# EAGLE design nedonand8 (EAGLE 5.12)
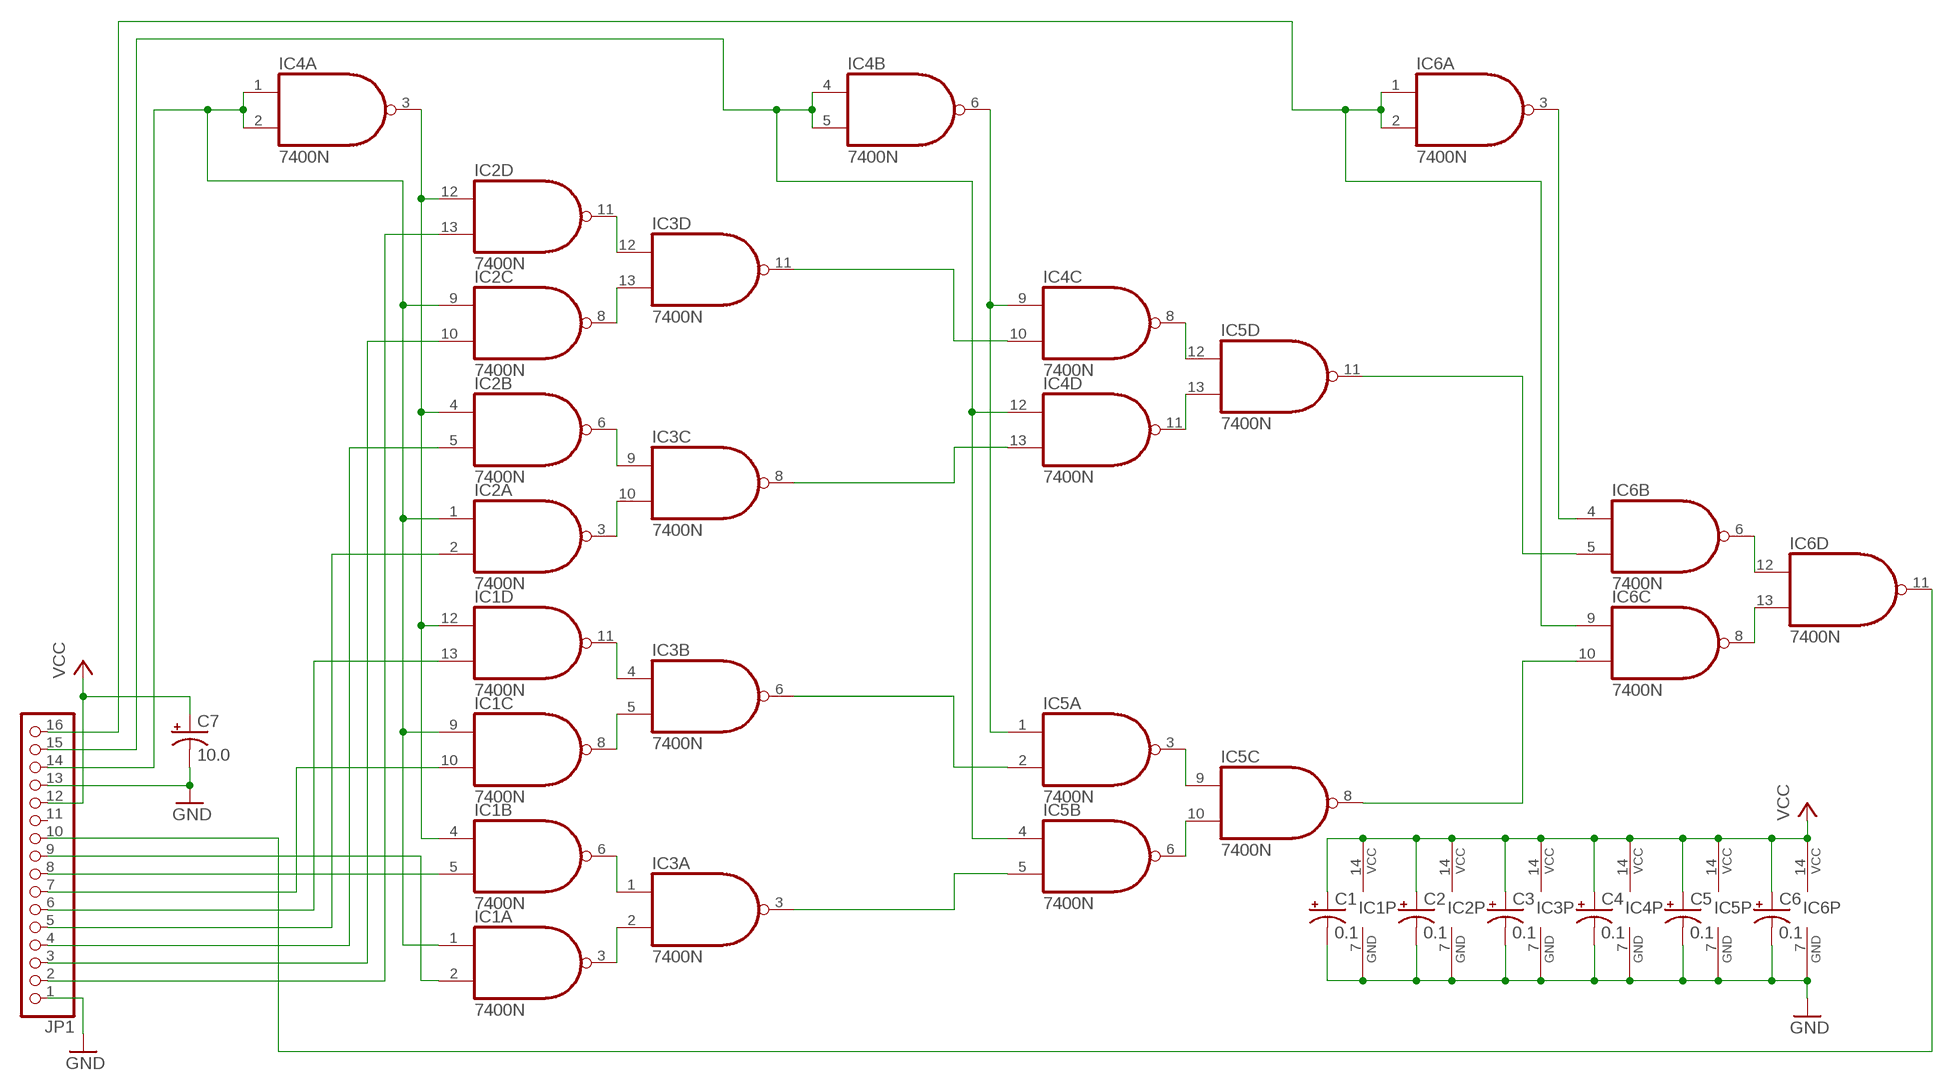
[diagram p0: schematic, sheet 1]

## Parts
C1  0.1  CPOL-USB45181A  [B45181A]
C2  0.1  CPOL-USB45181A  [B45181A]
C3  0.1  CPOL-USB45181A  [B45181A]
C4  0.1  CPOL-USB45181A  [B45181A]
C5  0.1  CPOL-USB45181A  [B45181A]
C6  0.1  CPOL-USB45181A  [B45181A]
C7  10.0  CPOL-USE2,5-6E  [E2,5-6E]
IC1  7400N  [DIL14]
IC2  7400N  [DIL14]
IC3  7400N  [DIL14]
IC4  7400N  [DIL14]
IC5  7400N  [DIL14]
IC6  7400N  [DIL14]
JP1  PINHD-1X16/90  [1X16/90]

## Nets
GND: C1.- C2.- C3.- C4.- C5.- C6.- C7.- IC1.7(P:GND) IC2.7(P:GND) IC3.7(P:GND) IC4.7(P:GND) IC5.7(P:GND) IC6.7(P:GND) JP1.1 JP1.13
N$2: IC4.4(B:I0) IC4.5(B:I1) IC4.12(D:I0) IC5.4(B:I0) JP1.15
N$3: IC6.1(A:I0) IC6.2(A:I1) IC6.9(C:I0) JP1.16
N$4: IC1.4(B:I0) IC1.12(D:I0) IC2.4(B:I0) IC2.12(D:I0) IC4.3(A:O)
N$5: IC1.1(A:I0) IC1.9(C:I0) IC2.1(A:I0) IC2.9(C:I0) IC4.1(A:I0) IC4.2(A:I1) JP1.14
N$6: IC2.13(D:I1) JP1.2
N$7: IC2.10(C:I1) JP1.3
N$8: IC2.5(B:I1) JP1.4
N$9: IC2.2(A:I1) JP1.5
N$10: IC1.13(D:I1) JP1.6
N$11: IC1.10(C:I1) JP1.7
N$12: IC1.5(B:I1) JP1.8
N$13: IC1.2(A:I1) JP1.9
N$14: IC2.11(D:O) IC3.12(D:I0)
N$15: IC2.8(C:O) IC3.13(D:I1)
N$16: IC2.6(B:O) IC3.9(C:I0)
N$17: IC2.3(A:O) IC3.10(C:I1)
N$18: IC1.11(D:O) IC3.4(B:I0)
N$19: IC1.8(C:O) IC3.5(B:I1)
N$20: IC1.6(B:O) IC3.1(A:I0)
N$21: IC1.3(A:O) IC3.2(A:I1)
N$22: IC4.6(B:O) IC4.9(C:I0) IC5.1(A:I0)
N$23: IC3.11(D:O) IC4.10(C:I1)
N$24: IC3.8(C:O) IC4.13(D:I1)
N$25: IC3.6(B:O) IC5.2(A:I1)
N$26: IC3.3(A:O) IC5.5(B:I1)
N$27: IC4.8(C:O) IC5.12(D:I0)
N$28: IC4.11(D:O) IC5.13(D:I1)
N$29: IC5.3(A:O) IC5.9(C:I0)
N$30: IC5.6(B:O) IC5.10(C:I1)
N$31: IC6.3(A:O) IC6.4(B:I0)
N$32: IC5.11(D:O) IC6.5(B:I1)
N$33: IC5.8(C:O) IC6.10(C:I1)
N$34: IC6.6(B:O) IC6.12(D:I0)
N$35: IC6.8(C:O) IC6.13(D:I1)
N$36: IC6.11(D:O) JP1.10
VCC: C1.+ C2.+ C3.+ C4.+ C5.+ C6.+ C7.+ IC1.14(P:VCC) IC2.14(P:VCC) IC3.14(P:VCC) IC4.14(P:VCC) IC5.14(P:VCC) IC6.14(P:VCC) JP1.12
Unconnected: JP1.11

## Library data of the parts
C1-C7 = rcl:CPOL-US: POLARIZED CAPACITOR, American symbol
IC1-IC6 = 74xx-us:74*00: Quad 2-input NAND gate
JP1 = pinhead:PINHD-1X16: PIN HEADER

## Board
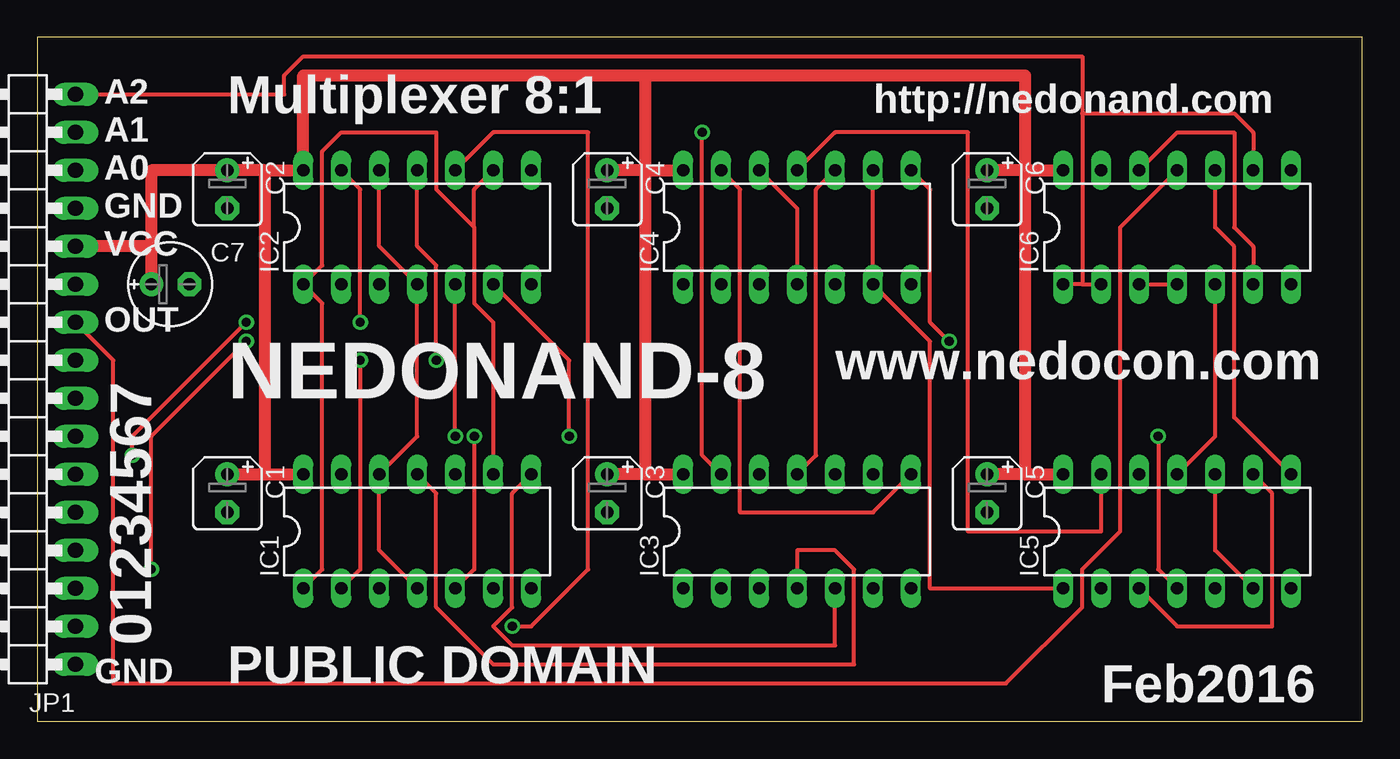
[diagram p1: board, top side]
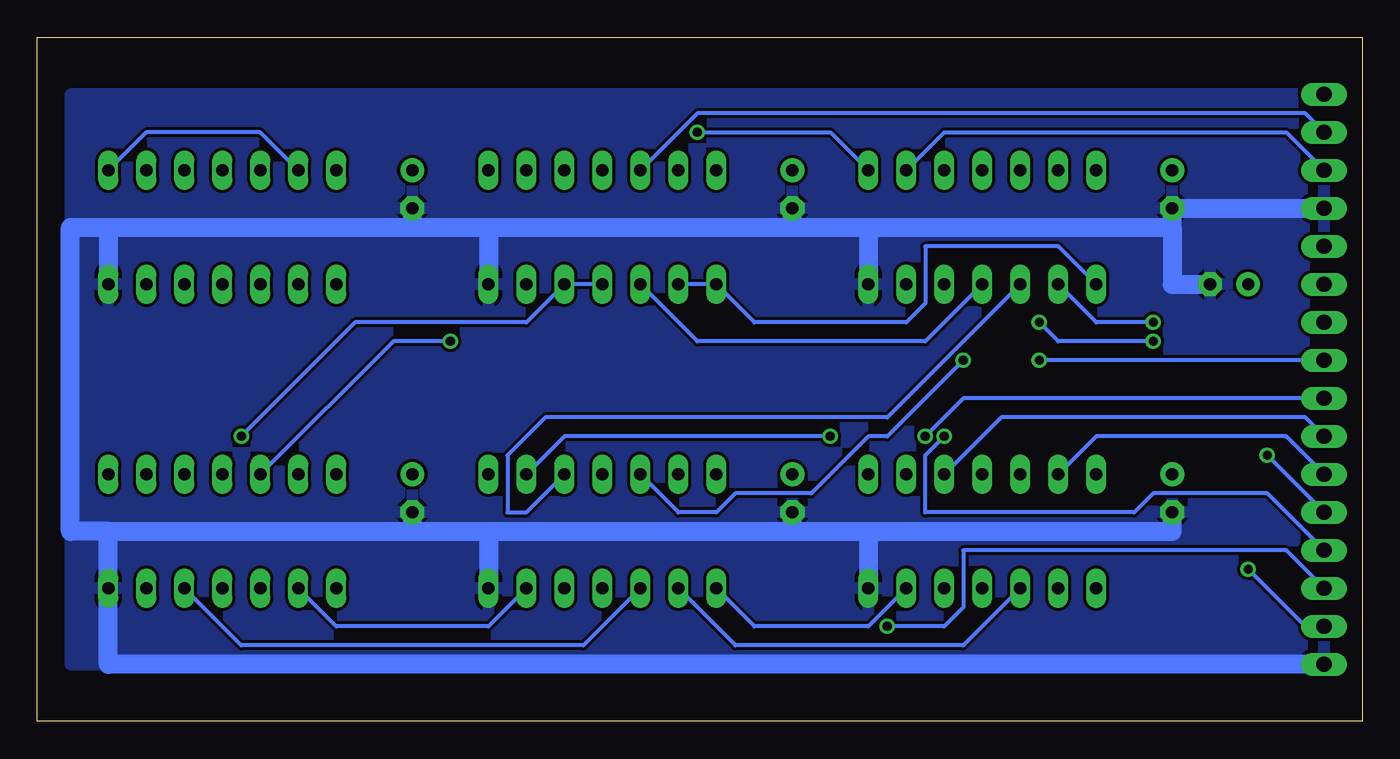
[diagram p2: board, bottom side, seen from below]

Size 88.57 x 45.71 mm. Coordinates in mm from the lower left corner, seen from the top.
Outline: 0,0 88.57,0 88.57,45.71 0,45.71 0,0
Copper layers (1*16): Top 0.035mm / dielectric 1.5mm / Bottom 0.035mm
Design rules "default": minimum track width 10mil, minimum drill 24mil, track to track 8mil, track to pad 8mil, pad to pad 8mil, via to via 8mil, smd to smd 8mil, copper to edge 40mil, drill to drill 8mil, minimum pad ring 10mil, minimum via ring 8mil, stop-mask expansion 4mil, vias tented up to drill 0mil, thermal gap 10mil

### Footprints (pad centres in the part's own frame; a part is rotated, then mirrored left to right if it is on the bottom)
B45181A = drill 0.813 pad 1.6 round: + -1.27,0 | drill 0.813 pad 1.6 octagon: - 1.27,0
E2,5-6E = drill 0.813 pad 1.575 round: + -1.27,0 | drill 0.813 pad 1.575 octagon: - 1.27,0
DIL14 = drill 0.813 long: 1 -7.62,-3.81; 2 -5.08,-3.81; 3 -2.54,-3.81; 4 0,-3.81; 5 2.54,-3.81; 6 5.08,-3.81; 7 7.62,-3.81; 8 7.62,3.81; 9 5.08,3.81; 10 2.54,3.81; 11 0,3.81; 12 -2.54,3.81; 13 -5.08,3.81; 14 -7.62,3.81
1X16/90 = drill 1.016 long: 1 -19.05,-3.81; 2 -16.51,-3.81; 3 -13.97,-3.81; 4 -11.43,-3.81; 5 -8.89,-3.81; 6 -6.35,-3.81; 7 -3.81,-3.81; 8 -1.27,-3.81; 9 1.27,-3.81; 10 3.81,-3.81; 11 6.35,-3.81; 12 8.89,-3.81; 13 11.43,-3.81; 14 13.97,-3.81; 15 16.51,-3.81; 16 19.05,-3.81

### Placement (x,y rotation side)
C1  12.7,15.24 270 top
C2  12.7,35.56 270 top
C3  38.1,15.24 270 top
C4  38.1,35.56 270 top
C5  63.5,15.24 270 top
C6  63.5,35.56 270 top
C7  8.89,29.21 0 top
IC1  25.4,12.7 0 top
IC2  25.4,33.02 0 top
IC3  50.8,12.7 0 top
IC4  50.8,33.02 0 top
IC5  76.2,12.7 0 top
IC6  76.2,33.02 0 top
JP1  -1.27,22.86 90 top

### Tracks (layer width: path | path; a pad name or v marks a point on that pad's centre or on a via)
GND
  Bottom 1.27: JP1.1 83.82,3.81 IC5.7 83.82,12.7 | 83.82,12.7 63.5,12.7 | 63.5,12.7 58.42,12.7 | 58.42,12.7 38.1,12.7 | 38.1,12.7 33.02,12.7 | 33.02,12.7 12.7,12.7 C1.- | 83.82,12.7 86.36,12.7 86.36,33.02 83.82,33.02 | 83.82,33.02 63.5,33.02 | 63.5,33.02 58.42,33.02 | 58.42,33.02 38.1,33.02 | 38.1,33.02 33.02,33.02 | 33.02,33.02 12.7,33.02 | 12.7,33.02 C2.- JP1.13 | C7.- 12.7,29.21 12.7,33.02 | 33.02,33.02 IC2.7 | 38.1,33.02 C4.- | 63.5,33.02 C6.- | 58.42,33.02 IC4.7 | 83.82,33.02 IC6.7 | 63.5,12.7 C5.- | 58.42,12.7 IC3.7 | 38.1,12.7 C3.- | 33.02,12.7 IC1.7
  pour Bottom: 2.54,41.91 86.36,41.91 86.36,3.81 2.54,3.81
N$2  (via drill 0.61)
  Top 0.254: IC5.4 74.93,10.16 v74.93,19.05 | IC4.12 50.8,34.29 IC4.4
  Bottom 0.254: IC4.4 IC4.5 55.88,26.67 67.31,26.67 v74.93,19.05 | JP1.15 3.81,40.64 44.45,40.64 IC4.12
N$3
  Top 0.254: 69.85,29.21 IC6.2 | 69.85,29.21 IC6.1 | IC6.9 81.28,39.37 80.01,40.64 69.85,40.64 | 69.85,40.64 69.85,29.21 | JP1.16 16.51,41.91 16.51,43.18 17.78,44.45 69.85,44.45 69.85,40.64
N$4
  Top 0.254: IC1.4 22.86,11.43 IC1.12 25.4,19.05 IC2.4 22.86,31.75 IC2.12
  Bottom 0.254: IC4.3 44.45,25.4 29.21,25.4 IC2.4
N$5
  Top 0.254: IC1.1 19.05,10.16 19.05,27.94 IC2.1 19.05,30.48 19.05,38.1 20.32,39.37 26.67,39.37 26.67,35.56 29.21,33.02 | IC1.9 30.48,26.67 29.21,27.94 29.21,33.02 | 29.21,33.02 29.21,35.56 IC2.9
  Bottom 0.254: IC4.2 IC4.1 40.64,26.67 30.48,26.67 29.21,27.94 29.21,31.75 20.32,31.75 IC2.1 | JP1.14 5.08,39.37 27.94,39.37 IC2.9
N$6  (via drill 0.61)
  Top 0.254: IC2.13 21.59,35.56 v21.59,26.67 | v13.97,25.4 7.62,19.05 v7.62,10.16
  Bottom 0.254: v21.59,26.67 20.32,25.4 v13.97,25.4 | v7.62,10.16 3.81,6.35 JP1.2
N$7  (via drill 0.61)
  Top 0.254: IC2.10 30.48,39.37 36.83,39.37 36.83,10.16 33.02,6.35 v31.75,6.35
  Bottom 0.254: v31.75,6.35 27.94,6.35 26.67,7.62 26.67,11.43 5.08,11.43 JP1.3
N$8  (via drill 0.61)
  Top 0.254: v27.94,19.05 IC2.5
  Bottom 0.254: v27.94,19.05 29.21,17.78 29.21,13.97 15.24,13.97 13.97,15.24 6.35,15.24 JP1.4
N$9  (via drill 0.61)
  Top 0.254: v13.97,26.67 6.35,19.05 v6.35,17.78
  Bottom 0.254: IC2.2 17.78,26.67 v13.97,26.67 | JP1.5 v6.35,17.78
N$10
  Bottom 0.254: IC1.13 17.78,19.05 5.08,19.05 JP1.6
N$11
  Bottom 0.254: IC1.10 24.13,20.32 3.81,20.32 JP1.7
N$12  (via drill 0.61)
  Top 0.254: IC1.5 29.21,10.16 v29.21,19.05
  Bottom 0.254: v29.21,19.05 26.67,21.59 JP1.8
N$13  (via drill 0.61)
  Top 0.254: IC1.2 21.59,10.16 v21.59,24.13
  Bottom 0.254: JP1.9 v21.59,24.13
N$14  (via drill 0.61)
  Top 0.254: IC2.11 25.4,31.75 26.67,30.48 v26.67,24.13
  Bottom 0.254: v26.67,24.13 31.75,19.05 33.02,19.05 36.83,15.24 41.91,15.24 43.18,13.97 45.72,13.97 IC3.12
N$15  (via drill 0.61)
  Top 0.254: IC3.13 44.45,17.78 v44.45,39.37
  Bottom 0.254: v44.45,39.37 35.56,39.37 IC2.8
N$16  (via drill 0.61)
  Top 0.254: IC2.6 35.56,24.13 v35.56,19.05
  Bottom 0.254: v35.56,19.05 53.34,19.05 IC3.9
N$17
  Bottom 0.254: IC2.3 31.75,20.32 54.61,20.32 57.15,17.78 57.15,13.97 55.88,13.97 IC3.10
N$18
  Top 0.254: IC1.11 26.67,15.24 26.67,7.62 30.48,3.81 54.61,3.81 54.61,10.16 53.34,11.43 50.8,11.43 IC3.4
N$19
  Top 0.254: IC1.8 31.75,15.24 31.75,7.62 30.48,6.35 31.75,5.08 53.34,5.08 IC3.5
N$20
  Bottom 0.254: IC1.6 33.02,6.35 40.64,6.35 IC3.1
N$21
  Bottom 0.254: IC1.3 26.67,5.08 41.91,5.08 IC3.2
N$22
  Top 0.254: IC4.9 IC4.6 59.69,25.4 59.69,8.89 IC5.1
N$23
  Top 0.254: IC3.11 52.07,17.78 52.07,35.56 IC4.10
N$24
  Top 0.254: IC3.8 55.88,13.97 46.99,13.97 46.99,35.56 IC4.13
N$25
  Bottom 0.254: IC3.6 58.42,6.35 68.58,6.35 IC5.2
N$26
  Bottom 0.254: IC3.3 52.07,5.08 74.93,5.08 IC5.5
N$27  (via drill 0.61)
  Top 0.254: v60.96,25.4 59.69,26.67 59.69,35.56 IC4.8
  Bottom 0.254: IC5.12 64.77,25.4 v60.96,25.4
N$28
  Top 0.254: IC4.11 53.34,39.37 62.23,39.37 62.23,12.7 71.12,12.7 IC5.13
N$29
  Top 0.254: IC5.3 76.2,6.35 82.55,6.35 82.55,15.24 IC5.9
N$30
  Top 0.254: IC5.6 78.74,11.43 IC5.10
N$31
  Top 0.254: IC6.3 IC6.4
N$32
  Top 0.254: IC5.11 78.74,19.05 IC6.5
N$33
  Top 0.254: IC5.8 80.01,20.32 80.01,31.75 78.74,33.02 IC6.10
N$34
  Top 0.254: IC6.12 76.2,39.37 80.01,39.37 80.01,33.02 81.28,31.75 IC6.6
N$35
  Bottom 0.254: IC6.13 73.66,39.37 81.28,39.37 IC6.8
N$36
  Top 0.254: IC6.11 72.39,33.02 72.39,12.7 69.85,10.16 69.85,7.62 64.77,2.54 5.08,2.54 5.08,24.13 JP1.10
VCC
  Top 0.813: 7.62,31.75 JP1.12 | 7.62,31.75 C7.+ | 7.62,31.75 7.62,36.83 C2.+ 15.24,36.83 | 15.24,36.83 IC2.14 17.78,43.18 40.64,43.18 | 40.64,43.18 40.64,36.83 | 40.64,36.83 C4.+ | 40.64,36.83 IC4.14 | 66.04,36.83 C6.+ | 66.04,36.83 66.04,43.18 40.64,43.18 | 66.04,36.83 IC6.14 | 66.04,16.51 IC5.14 | 66.04,36.83 66.04,16.51 | 66.04,16.51 C5.+ | 40.64,16.51 IC3.14 | 40.64,36.83 40.64,16.51 | 40.64,16.51 C3.+ | 15.24,16.51 IC1.14 | 15.24,16.51 15.24,36.83 | C1.+ 15.24,16.51

### Text on the board
tNames: A2 | Multiplexer 8:1 | http://nedonand.com | A1 | A0 | GND | VCC | OUT | www.nedocon.com | NEDONAND-8 | 01234567 | GND | PUBLIC DOMAIN | Feb2016